# Altium schematic sheet PORT_SINGLE.SchDoc
size A4; SheetNumber: 8; SheetTotal: 8
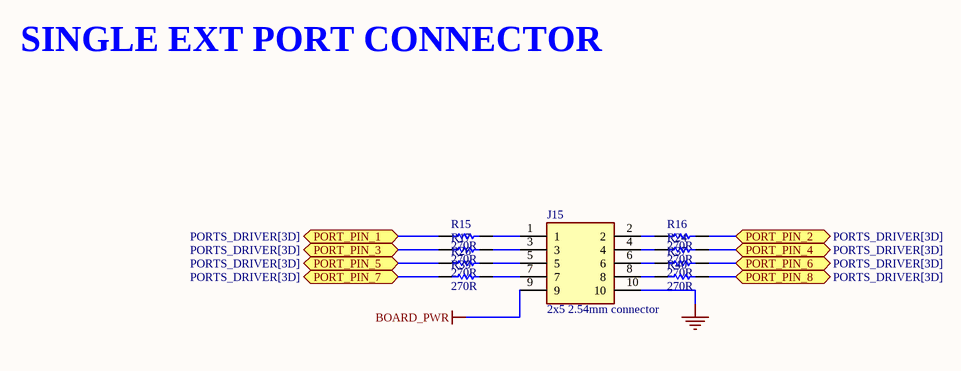
[diagram p0: PORT_SINGLE.SchDoc]

## Parts
J15  2x5 2.54mm connector  [SHDR10W64P254_2X5_2032X910X935P]
R15  270R  [RESC1005X40X25NL05T05]
R16  270R  [RESC1005X40X25NL05T05]
R17  270R  [RESC1005X40X25NL05T05]
R24  270R  [RESC1005X40X25NL05T05]
R26  270R  [RESC1005X40X25NL05T05]
R37  270R  [RESC1005X40X25NL05T05]
R39  270R  [RESC1005X40X25NL05T05]
R40  270R  [RESC1005X40X25NL05T05]

## Ports
PORT_PIN_1 (bidir, see PORTS_DRIVER[3D]), PORT_PIN_2 (bidir, see PORTS_DRIVER[3D]), PORT_PIN_3 (bidir, see PORTS_DRIVER[3D]), PORT_PIN_4 (bidir, see PORTS_DRIVER[3D]), PORT_PIN_5 (bidir, see PORTS_DRIVER[3D]), PORT_PIN_6 (bidir, see PORTS_DRIVER[3D]), PORT_PIN_7 (bidir, see PORTS_DRIVER[3D]), PORT_PIN_8 (bidir, see PORTS_DRIVER[3D])

## Nets
BOARD_PWR: J15.9
GND: J15.10
PORT_PIN_1: R15.2 ; port PORT_PIN_1
PORT_PIN_2: R16.1 ; port PORT_PIN_2
PORT_PIN_3: R17.2 ; port PORT_PIN_3
PORT_PIN_4: R24.1 ; port PORT_PIN_4
PORT_PIN_5: R26.2 ; port PORT_PIN_5
PORT_PIN_6: R37.1 ; port PORT_PIN_6
PORT_PIN_7: R39.2 ; port PORT_PIN_7
PORT_PIN_8: R40.1 ; port PORT_PIN_8
NetJ15_1: J15.1 R15.1
NetJ15_2: J15.2 R16.2
NetJ15_3: J15.3 R17.1
NetJ15_4: J15.4 R24.2
NetJ15_5: J15.5 R26.1
NetJ15_6: J15.6 R37.2
NetJ15_7: J15.7 R39.1
NetJ15_8: J15.8 R40.2

## Notes on the sheet
- SINGLE EXT PORT CONNECTOR

## Library data of the parts
J15 = connector - 5x2 -  2.54x2.54mm: 2x5position -  2.54x2.54mm connector; PartNumber: G821EU210AAL10Y; ComponentLink1Description: myLinks; ComponentLink1URL: https://cz.mouser.com/ProductDetail/Amphenol-Commercial-Products/G821EU210AAL10Y?qs=f9yNj16SXrKgfgt6Mg6Piw%3D%3D; Value: 2x5position -  2.54x2.54mm connector; Package: 2x5position -  2.54x2.54mm connector; Supplier 1: Mouser; Supplier Part Number 1: 523-G821EU210AAL10Y
R15-R17 R24 R26 R37 R39 R40 = Resistor - 0402 -270R: Resistor - 0402 - 270R - 1% - 125mW; PartNumber: CRGP0402F270R; Value: 270R; Package: 0402; ComponentLink1Description: myLinks; ComponentLink1URL: https://cz.mouser.com/ProductDetail/TE-Connectivity-Holsworthy/CRGP0402F270R?qs=wUXugUrL1qyX8E%252BNg7WV%252Bg%3D%3D; Supplier 1: Mouser; Supplier Part Number 1: 279-CRGP0402F270R